# Altium schematic sheet uart_usb_bridge.SchDoc
size A4
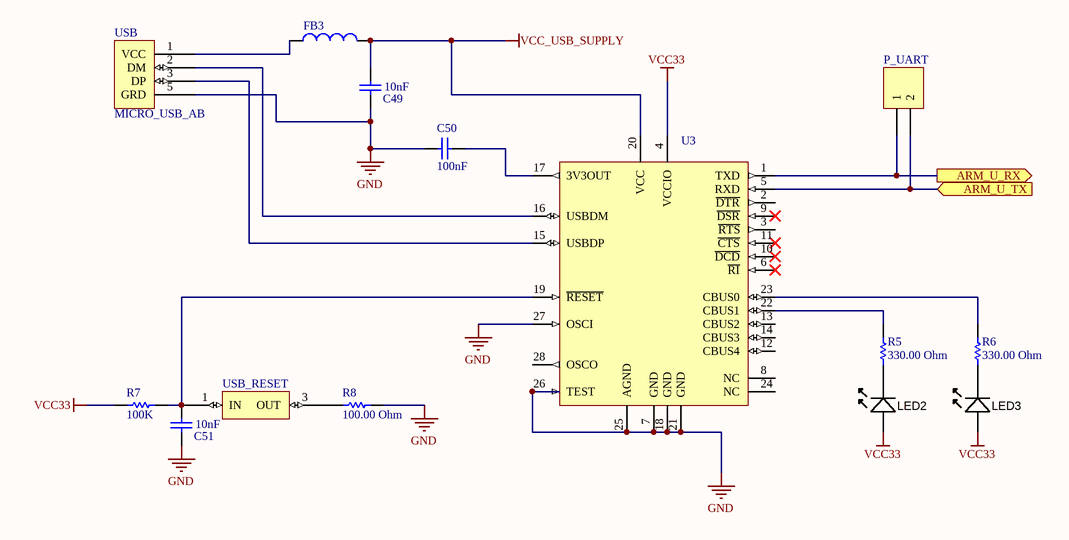
[diagram p0: uart_usb_bridge.SchDoc]

## Parts
C49  10nF  [CAPC0805(2012)75_N]
C50  100nF  [CAPC0805(2012)100_M]
C51  10nF  [CAPC0805(2012)75_N]
FB3  Inductor  [INDC3216]  (value not drawn)
LED2  Red  [LED-0805-A]  (value not drawn)
LED3  Red  [LED-0805-A]  (value not drawn)
P_UART  Header 2  [HDR1X2]  (value not drawn)
R5  330.00 Ohm  [RESC0805(2012)_M]
R6  330.00 Ohm  [RESC0805(2012)_M]
R7  100K  [RESC0805(2012)_L]
R8  100.00 Ohm  [RESC0805(2012)_M]
U3  FT232RL-Reel  [SSOP-28_N]  (value not drawn)
USB  MICRO_USB_AB  [MICRO_USB_AB]
USB_RESET  BUTTON  [BUTTON]  (value not drawn)

## Ports
ARM_U_RX (out), ARM_U_TX (in)

## Nets
GND: C49.1 C50.2 C51.1 R8.2 U3.7(GND) U3.18(GND) U3.21(GND) U3.25(AGND) U3.26(TEST) U3.27(OSCI) USB.5(GRD)
VCC33: LED2.A LED3.A R7.2 U3.4(VCCIO)
VCC_USB_SUPPLY: C49.2 FB3.2 U3.20(VCC)
ARM_U_RX: P_UART.1 U3.1(TXD) ; port ARM_U_RX
ARM_U_TX: P_UART.2 U3.5(RXD) ; port ARM_U_TX
NetC50_1: C50.1 U3.17(3V3OUT)
NetC51_2: C51.2 R7.1 U3.19(~{RESET}) USB_RESET.1(IN)
NetFB3_1: FB3.1 USB.1(VCC)
NetLED2_K: LED2.K R5.1
NetLED3_K: LED3.K R6.1
NetR5_2: R5.2 U3.22(CBUS1)
NetR6_2: R6.2 U3.23(CBUS0)
NetR8_1: R8.1 USB_RESET.3(OUT)
NetU3_15: U3.15(USBDP) USB.3(DP)
NetU3_16: U3.16(USBDM) USB.2(DM)

Not connected (* = marked no-connect by the designer): U3 2(~{DTR}) 3(~{RTS}) 6(~{RI})* 8(NC) 9(~{DSR})* 10(~{DCD})* 11(~{CTS})* 12(CBUS4) 13(CBUS2) 14(CBUS3) 24(NC) 28(OSCO)

## Library data of the parts
C49 C51 = CMP-1036-03842-1: CAP 10nF 50V ±10% 0805 (2012 Metric) Thickness 0.75mm SMD; Case-Metric: 2012; Case-EIA: 0805; Value: 10nF; Max Thickness: 0.75 mm; Rated Voltage: 50 V; Tolerance: ±10%; Technology: SMT
C50 = CMP-1036-04420-1: CAP 100nF 50V ±10% 0805 (2012 Metric) Thickness 1mm SMD; Case-EIA: 0805; Case-Metric: 2012; Rated Voltage: 50 V; Value: 100nF; Tolerance: ±10%; Max Thickness: 1 mm; Technology: SMT
FB3 = Inductor: Value: 10mH; Code_IEC: 1005; Published: 8-Jun-2000; LatestRevisionDate: 29-May-2009; LatestRevisionNote: IPC-7351 Footprint Added.; PackageReference: 0402-A; Publisher: Altium Limited; PackageDescription: Chip Inductor; Code_JEITA: 0402
LED2 LED3 = LED_SMD_Red_0805: LED, 0805 SMD, Red; Manufacturer 1: Ligitek; Manufacturer Part Number 1: LG170SR-CT; Material: GaAIAs; Ratings: 20 mcd; 643 nm; Package / Case: 0805
P_UART = Header 2: Header, 2-Pin; LatestRevisionDate: 17-Jul-2002; LatestRevisionNote: Re-released for DXP Platform.; Publisher: Altium Limited
R5 R6 = CMP-1013-00454-1: 330R 0.125W 1% 0805 (2012 Metric)  SMD; Case-EIA: 0805; Case-Metric: 2012; Value: 330.00 Ohm; Power: 0.125 W; Tolerance: 1 %; Technology: SMT
R7 = CMP-1013-00122-1: 100K 0.125W 5% 0805 (2012 Metric)  SMD; Case-Metric: 2012; Value: 100000.00 Ohm; Case-EIA: 0805; Tolerance: 5 %; Technology: SMT; Power: 0.125 W
R8 = CMP-1013-00050-1: 100R 0.125W 5% 0805 (2012 Metric)  SMD; Case-EIA: 0805; Case-Metric: 2012; Tolerance: 5 %; Power: 0.125 W; Technology: SMT; Value: 100.00 Ohm
U3 = FT232RL-Reel: USB UART Asynchronous Serial Data Transfer Chip, SSOP-28, Tape and Reel; DatasheetVersion: ver 2.09, Apr-2011; PackageVersion: 2010; PackageReference: SSOP-28; PackageDescription: 28-Pin Small Outline Package 0.65 mm Pitch; ComponentLink1Description: Manufacturer URL; ComponentLink1URL: http://www.ftdichip.com/; ComponentLink2Description: Datasheet; ComponentLink2URL: http://www.ftdichip.com/Support/Documents/DataSheets/ICs/DS_FT232R.pdf